# EAGLE schematic RFM69 USB Gateway 0.7 (EAGLE 7.6.0)
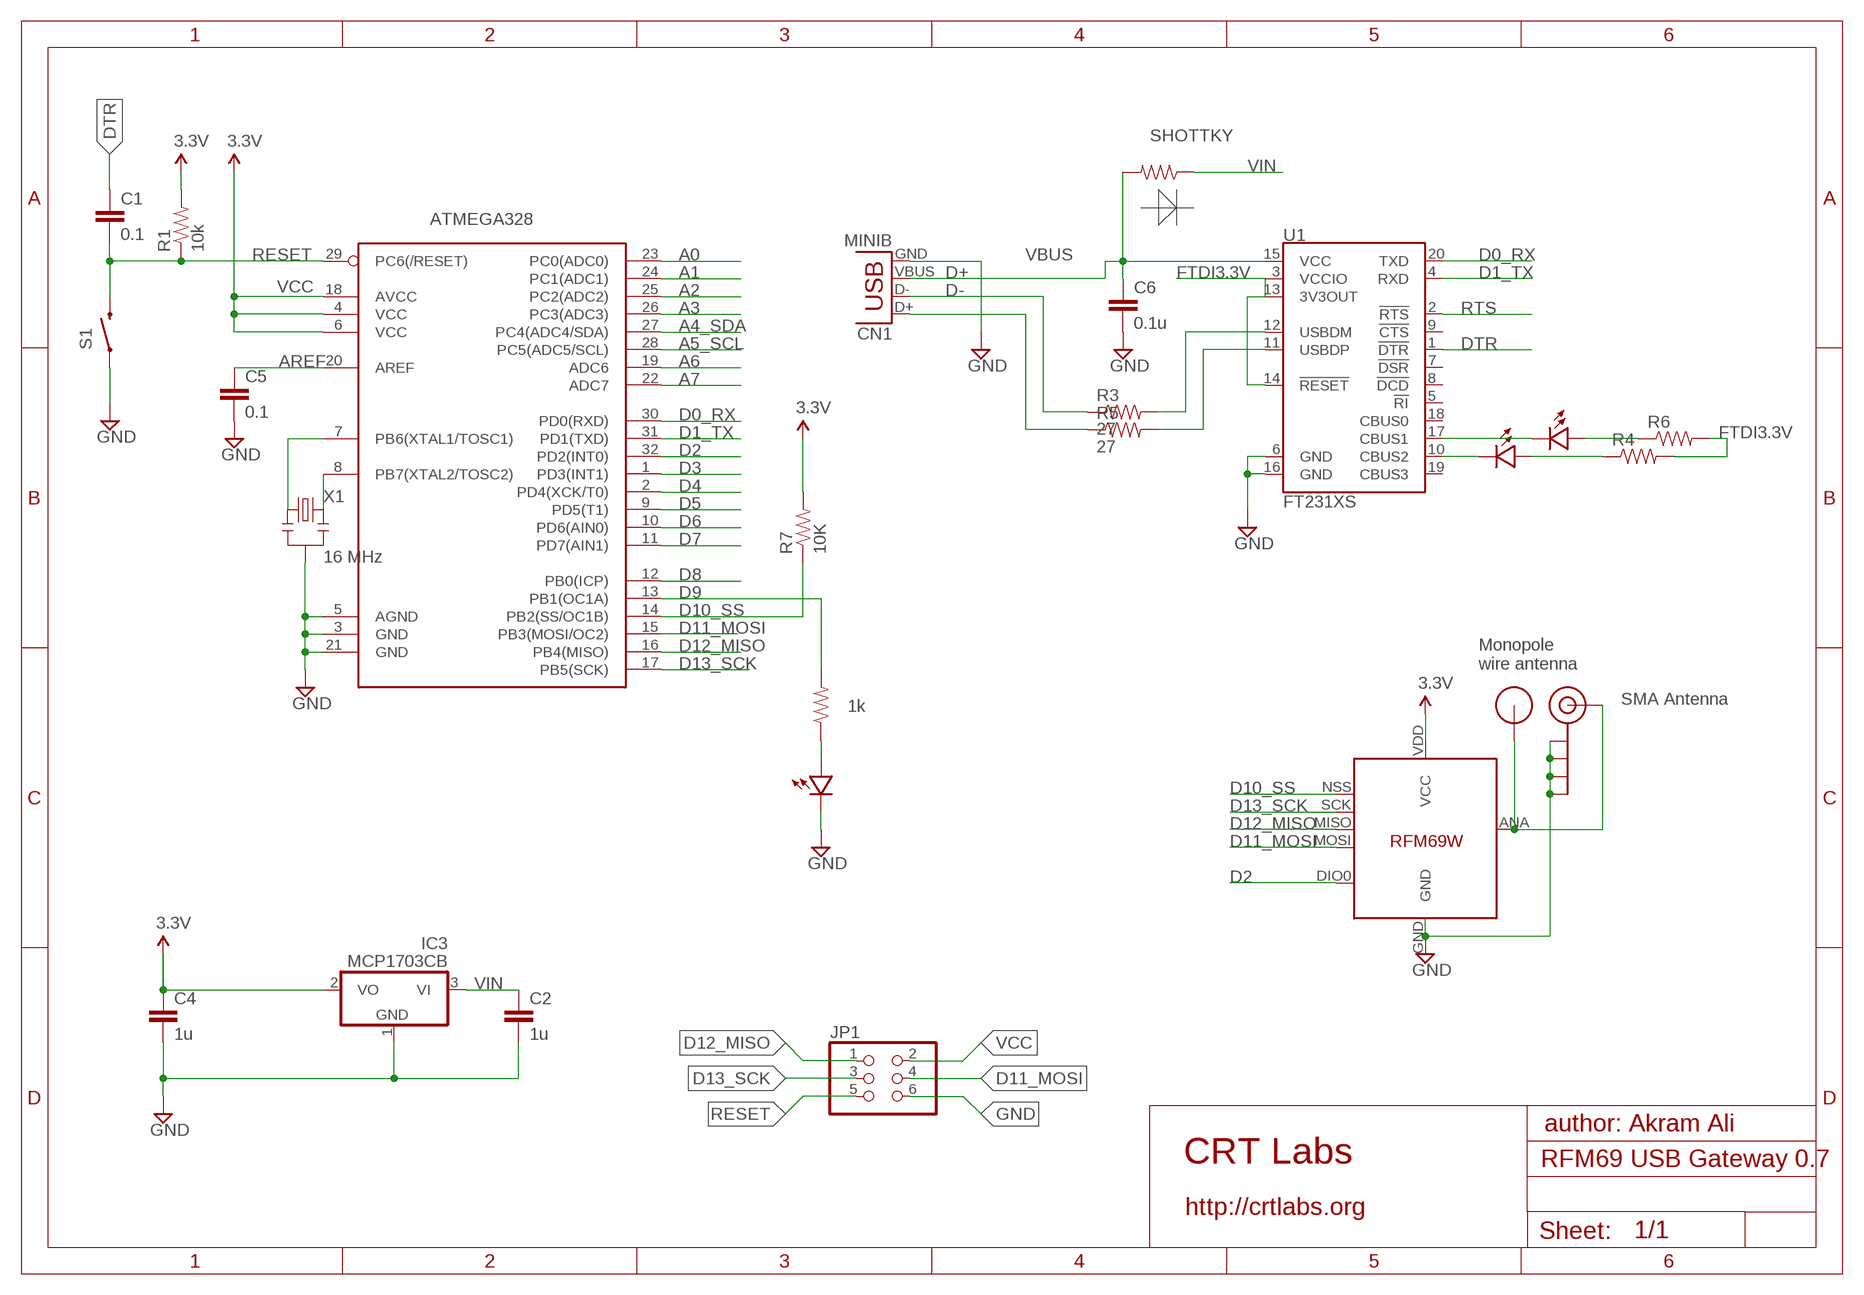
[diagram p0: schematic, sheet 1]

## Parts
ATMEGA328  ATMega-328  ATMEGA168/328TQFP32  [TQFP32-08]
C1  0.1  CAP0805  [0805]
C2  1u  CAP0805  [0805]
C4  1u  CAP0805  [0805]
C5  0.1  CAP0805  [0805]
C6  0.1u  CAP0805  [0805]
CN1  MINIB  USB-A-H  [USB-A-H]
D  SHOTTKY  RESISTOR0805  [0805]
IC3  MCP1703CB  [SOT23]
J$1  SMA_EDGE  [SMA-EDGE]
JP1  PINHD-2X3  [2X03]
R1  10k  RESISTOR0805  [0805]
R2  1k  RESISTOR0805-RES  [0805]
R3  27  RESISTOR0805-RES  [0805]
R4  RESISTOR0805-RES  [0805]
R5  27  RESISTOR0805-RES  [0805]
R6  RESISTOR0805-RES  [0805]
R7  10K  RESISTOR0805-RES  [0805]
S1  SWITCH-MOMENTARY-2SMD-ALT01  [TACTILE-SWITCH-SMD-ALT01]
U1  FT231XS  [SSOP20_L]
U$1  RFM12B_ANTENNA  [RFM12B-ANTENNA]
U$2  LED0805  [0805-LED]
U$4  LED0805  [0805-LED]
U$5  RFM69  [RFM69W-MINPADS]
U$7  LED0805  [0805-LED]
X1  16 MHz  RESONATORSMD  [RESONATOR-SMD]

## Nets
A0: ATMEGA328.23(PC0(ADC0))
A1: ATMEGA328.24(PC1(ADC1))
A2: ATMEGA328.25(PC2(ADC2))
A3: ATMEGA328.26(PC3(ADC3))
A4_SDA: ATMEGA328.27(PC4(ADC4/SDA))
A5_SCL: ATMEGA328.28(PC5(ADC5/SCL))
A6: ATMEGA328.19(ADC6)
A7: ATMEGA328.22(ADC7)
AREF: ATMEGA328.20(AREF) C5.1
D0_RX: ATMEGA328.30(PD0(RXD)) U1.20(TXD)
D1_TX: ATMEGA328.31(PD1(TXD)) U1.4(RXD)
D2: ATMEGA328.32(PD2(INT0)) U$5.DIO0
D3: ATMEGA328.1(PD3(INT1))
D4: ATMEGA328.2(PD4(XCK/T0))
D5: ATMEGA328.9(PD5(T1))
D6: ATMEGA328.10(PD6(AIN0))
D7: ATMEGA328.11(PD7(AIN1))
D8: ATMEGA328.12(PB0(ICP))
D9: ATMEGA328.13(PB1(OC1A)) R2.2
D10_SS: ATMEGA328.14(PB2(SS/OC1B)) R7.1 U$5.NSS(SEL)
D11_MOSI: ATMEGA328.15(PB3(MOSI/OC2)) JP1.4 U$5.MOSI
D12_MISO: ATMEGA328.16(PB4(MISO)) JP1.1 U$5.MISO
D13_SCK: ATMEGA328.17(PB5(SCK)) JP1.3 U$5.SCK
D+: CN1.D+ R5.1
D-: CN1.D- R3.1
DTR: C1.1 U1.1(!DTR)
FTDI3.3V: R4.2 R6.2 U1.3(VCCIO) U1.13(3V3OUT) U1.14(!RESET)
GND [power]: ATMEGA328.3(GND) ATMEGA328.5(AGND) ATMEGA328.21(GND) C2.2 C4.2 C5.2 C6.2 CN1.GND IC3.1(GND) J$1.GND@0(GND) J$1.GND@1(GND) J$1.GND@2(GND) J$1.GND@3(GND) JP1.6 S1.1 S1.2 U1.6(GND) U1.16(GND) U$2.MINUS U$5.GND X1.2
N$1: ATMEGA328.7(PB6(XTAL1/TOSC1)) X1.1
N$2: R2.1 U$2.PLUS
N$3: J$1.SIG(SIGNAL) U$1.P$1 U$5.ANA(ANT)
N$4: R3.2 U1.12(USBDM)
N$5: R5.2 U1.11(USBDP)
N$6: U1.17(CBUS1) U$4.MINUS
N$7: U1.10(CBUS2) U$7.MINUS
N$8: R4.1 U$7.PLUS
N$9: R6.1 U$4.PLUS
N$21: ATMEGA328.8(PB7(XTAL2/TOSC2)) X1.3
RESET: ATMEGA328.29(PC6(/RESET)) C1.2 JP1.5 R1.1 S1.3 S1.4
RTS: U1.2(!RTS)
VBUS [power]: C6.1 CN1.VBUS D.2 U1.15(VCC)
VCC: ATMEGA328.4(VCC) ATMEGA328.6(VCC) ATMEGA328.18(AVCC) C4.1 IC3.2(VO) JP1.2 R1.2 R7.2 U$5.VDD(VCC) ; supply symbol labelled 3.3V
VIN: C2.1 D.1 IC3.3(VI)
Unconnected: U1.5(!RI) U1.7(!DSR) U1.8(!DCD) U1.9(!CTS) U1.18(CBUS0) U1.19(CBUS3)

## Notes on the sheet
- Monopole
  wire antenna
- SMA Antenna
- author: Akram Ali
- CRT Labs
- http://crtlabs.org

## Library data of the parts
ATMEGA328 = LowPowerLab:ATMEGA168/328: Atmel 32-pin 8-bit micro, 16k flash.
C1 C2 C5 C6 = SparkFun:CAP: Capacitor Standard 0603 ceramic capacitor, and 0.1" leaded capacitor.
C4 = LowPowerLab:CAP: Capacitor Standard 0603 ceramic capacitor, and 0.1" leaded capacitor.
CN1 = SparkFun-Connectors:USB: USB Connectors USB-B-PTH is fully proven SKU : PRT-00139/CONN-08278 USB-miniB is fully proven SKU : PRT-00587 USB-A-PCB is untested. USB-A-H is throughly reviewed, but untested. Spark Fun Electronics SKU : PRT-00437 USB-B-SMT is throughly reviewed, but untested. Needs silkscreen touching up. USB-A-S has not been used/tested USB-MB-H has not been used/tested USB-MICROB has been used. CONN-09505; PROD_ID: CONN-08367
D R1 = LowPowerLab:RESISTOR: Resistor Basic schematic elements and footprints for 0603, 1206, and PTH resistors.
IC3 = linear:MCP1703: 250 mA, 16V, Low Quiescent Current LDO Regulator Source: http://ww1.microchip.com/downloads/en/DeviceDoc/22049b.pdf
J$1 = SparkFun-Connectors:SMA_EDGE: SMA Antenna Connector End launch SMA connector. The paste layer has been removed so that the connector can be hand soldered onto the board after reflow.
JP1 = pinhead:PINHD-2X3: PIN HEADER
R2-R7 = SparkFun:RESISTOR: Resistor Basic schematic elements and footprints for 0603, 1206, and PTH resistors.
S1 = Testing:SWITCH-MOMENTARY-2: Various NO switches- pushbuttons, reed, etc
U1 = SparkFun-DigitalIC:FT231X: FTDI FT231X Full Speed USB to Full-handshake UART This USB2.0 Full Speed IC offers a compact bridge to full handshake UART interfaces. The device is a UART, capable of operating up to 3MBaud, with low power consumption (8mA). The FT231X includes the complete FT-X series feature set and enables USB to be added into a system design quickly and easily over a UART interface.; PROD_ID: IC-11524
U$1 = LowPowerLab:RFM12B_ANTENNA
U$2 U$4 U$7 = LowPowerLab:LED
U$5 = LowPowerLab:RFM69
X1 = SparkFun:RESONATOR: Resonator Small SMD resonator. This is the itty bitty 10/20MHz resonators with built in caps. CSTCE10M0G55 and CSTCE20M0V53. Footprint has been reviewed closely but hasn't been tested yet.

## Net classes
1 power: width 0.381 mm, clearance 0.254 mm